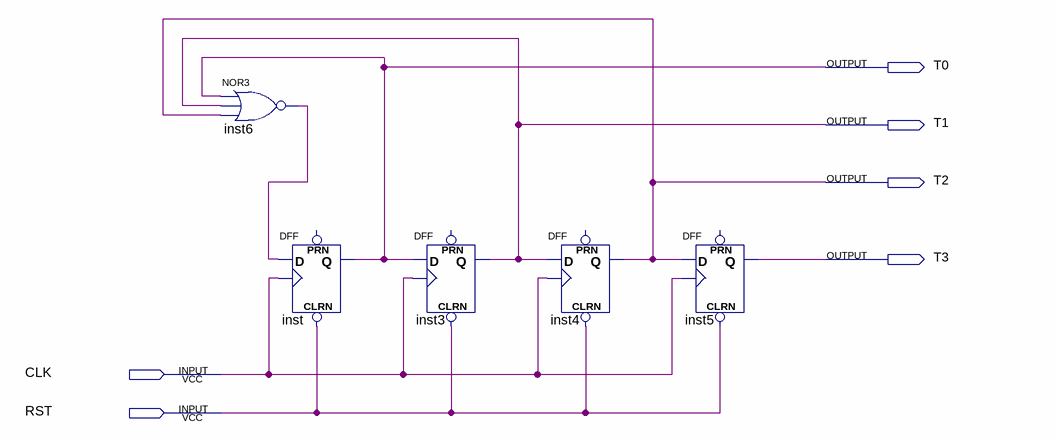
[diagram p0: schematic sheet]
// Quartus schematic MC.bdf as structural Verilog: 5 symbols, 6 pins
module MC (
  input  CLK,
  input  RST,
  output T0,
  output T1,
  output T2,
  output T3
);

  wire inst6_out;

  nor inst6 (inst6_out, T0, T1, T2);
  DFF inst (.CLRN(RST), .CLK(CLK), .D(inst6_out), .Q(T0));  // open: PRN
  DFF inst3 (.CLRN(RST), .CLK(CLK), .D(T0), .Q(T1));  // open: PRN
  DFF inst4 (.CLRN(RST), .CLK(CLK), .D(T1), .Q(T2));  // open: PRN
  DFF inst5 (.CLRN(RST), .CLK(CLK), .D(T2), .Q(T3));  // open: PRN
endmodule
